# EasyEDA Pro project msq_ethrottle_soic.eprj

# Schematic Schematic

## Sheets
1 MCU: Create Date: 2023-01-29; Page Name: MCU; Project Name: msq-dbw; Schematic Name: Schematic1; Update Date: 2023-03-14; Company: EasyEDA.com; Drawed: EasyEDA Pro; Page Size: A4; Part Number: JLCPCB-002; Reviewed: EasyEDA Pro; Version: V0.1
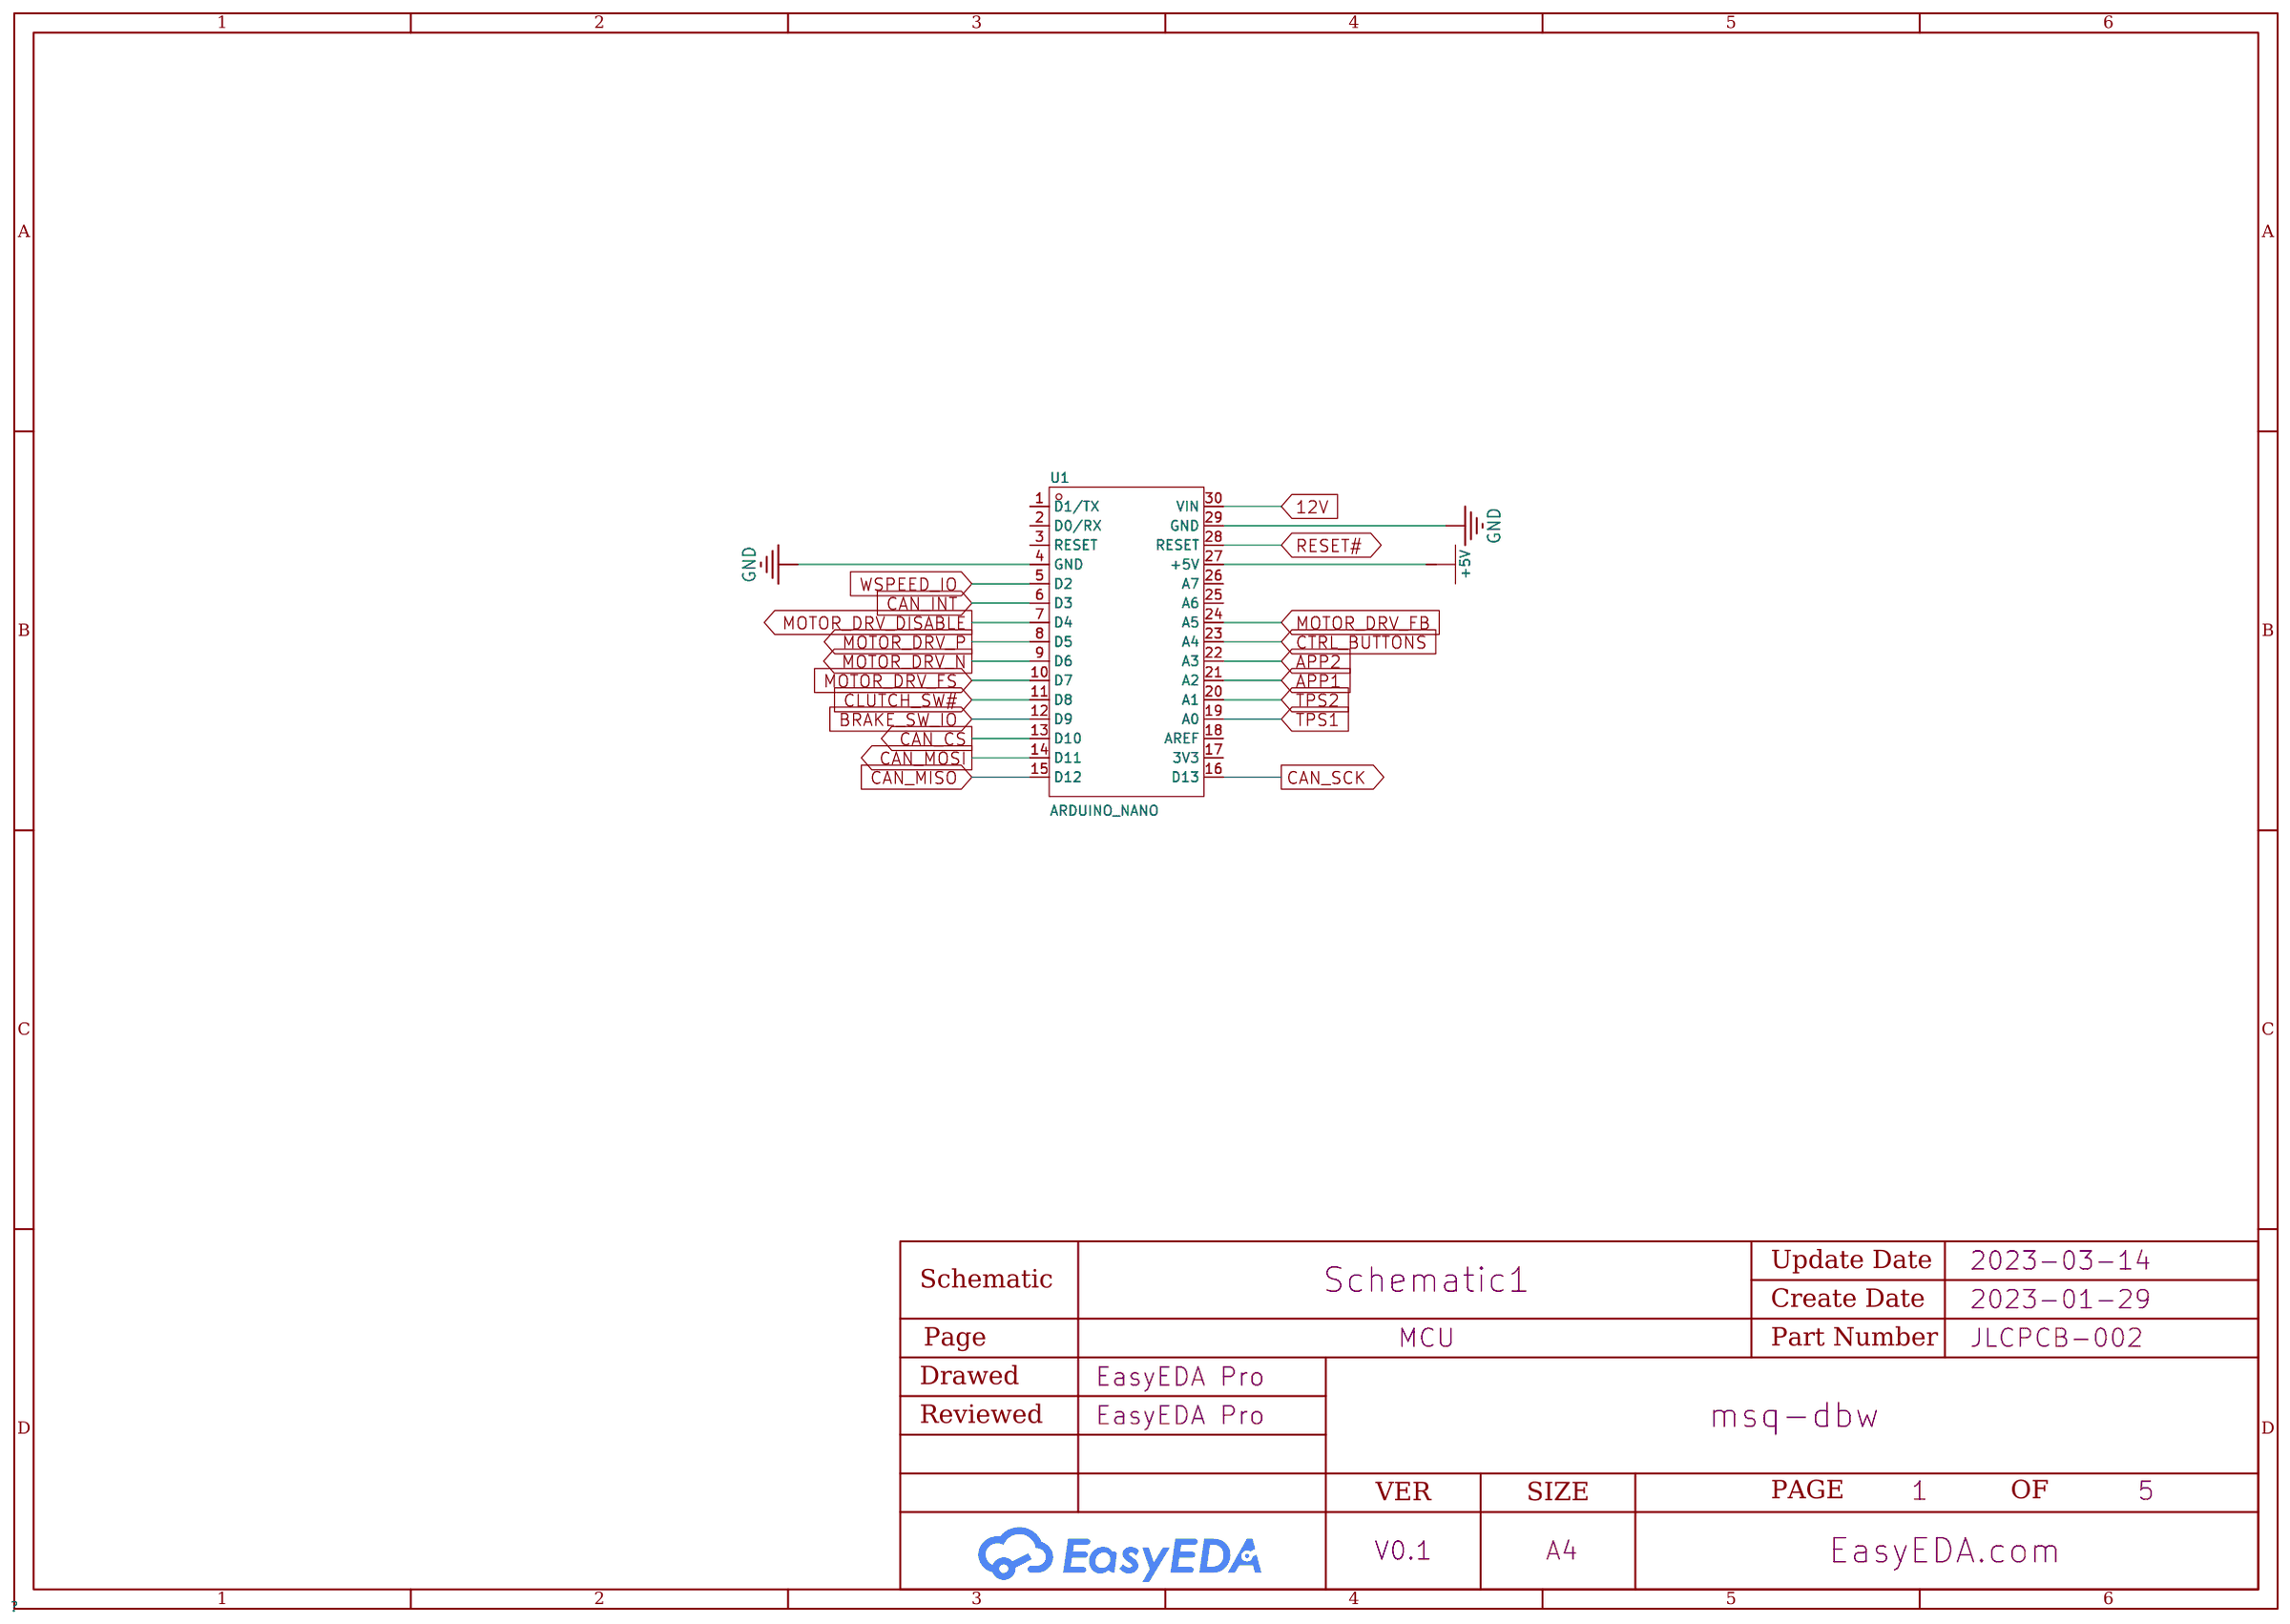
[diagram p0: MCU]
2 I/O: Page Name: I/O; Update Date: 2023-03-11
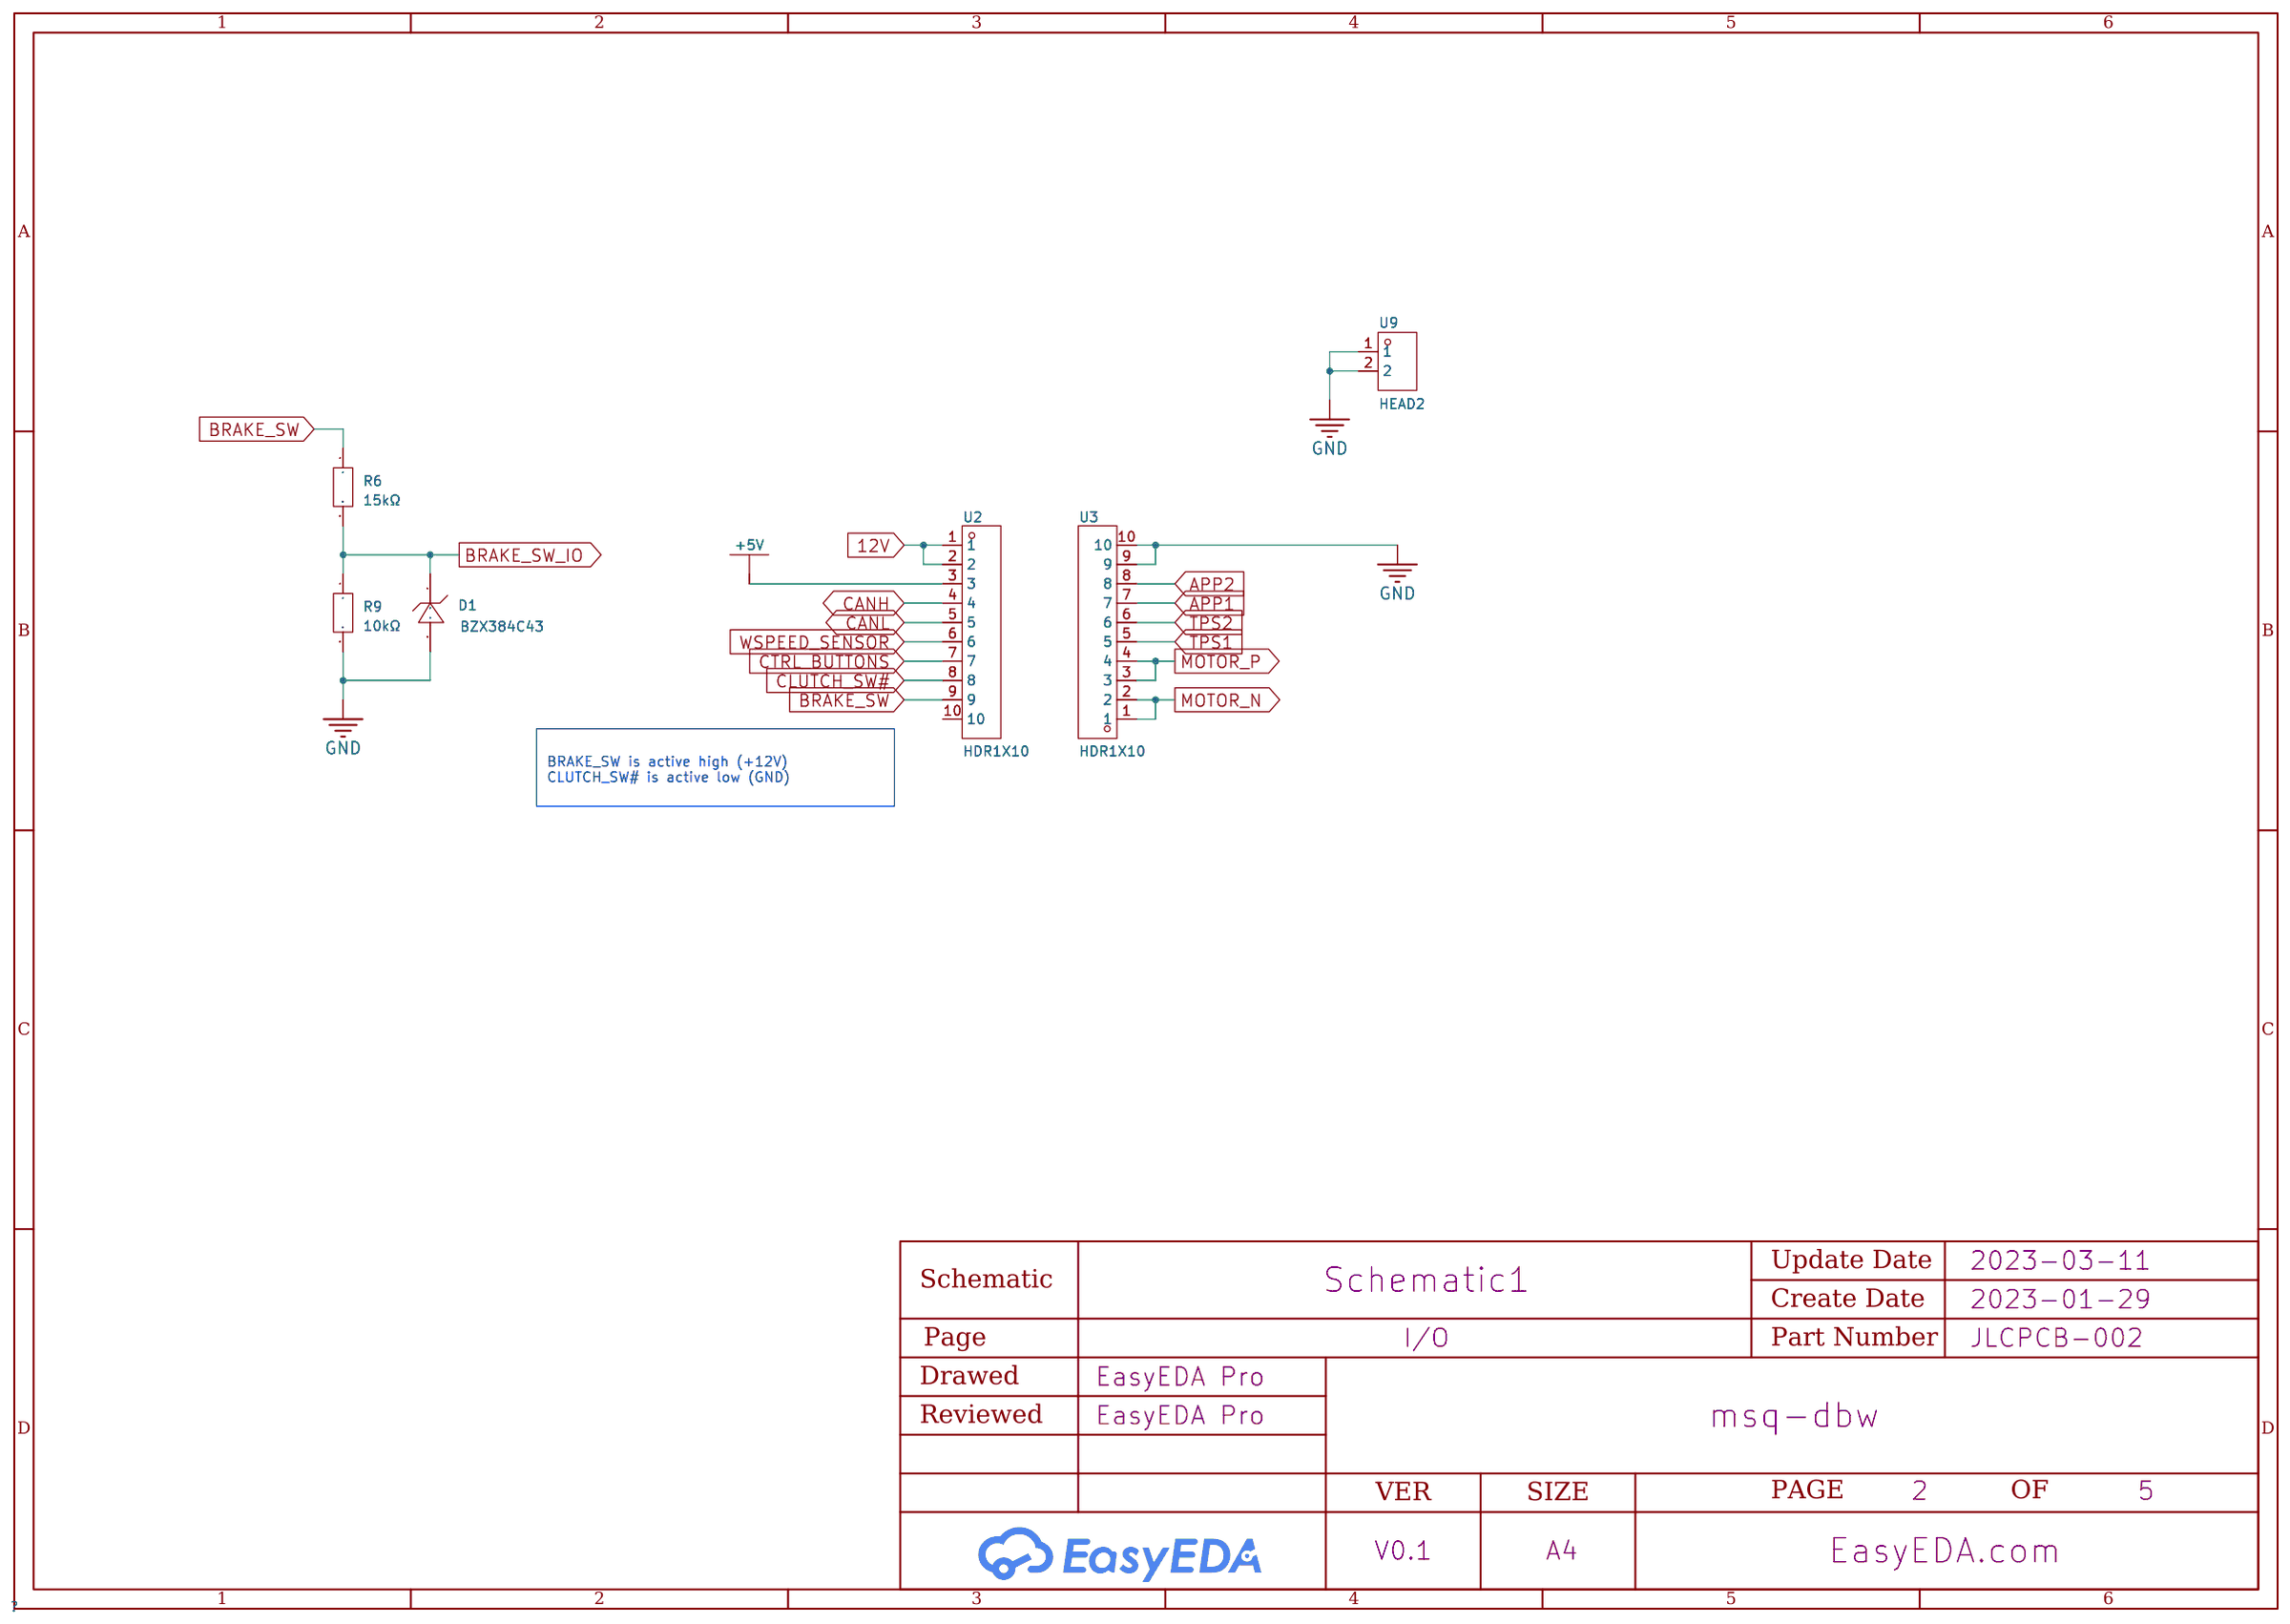
[diagram p1: I/O]
3 CAN: Page Name: CAN; Project Name: msq_ethrottle_soic; Update Date: 2023-03-17
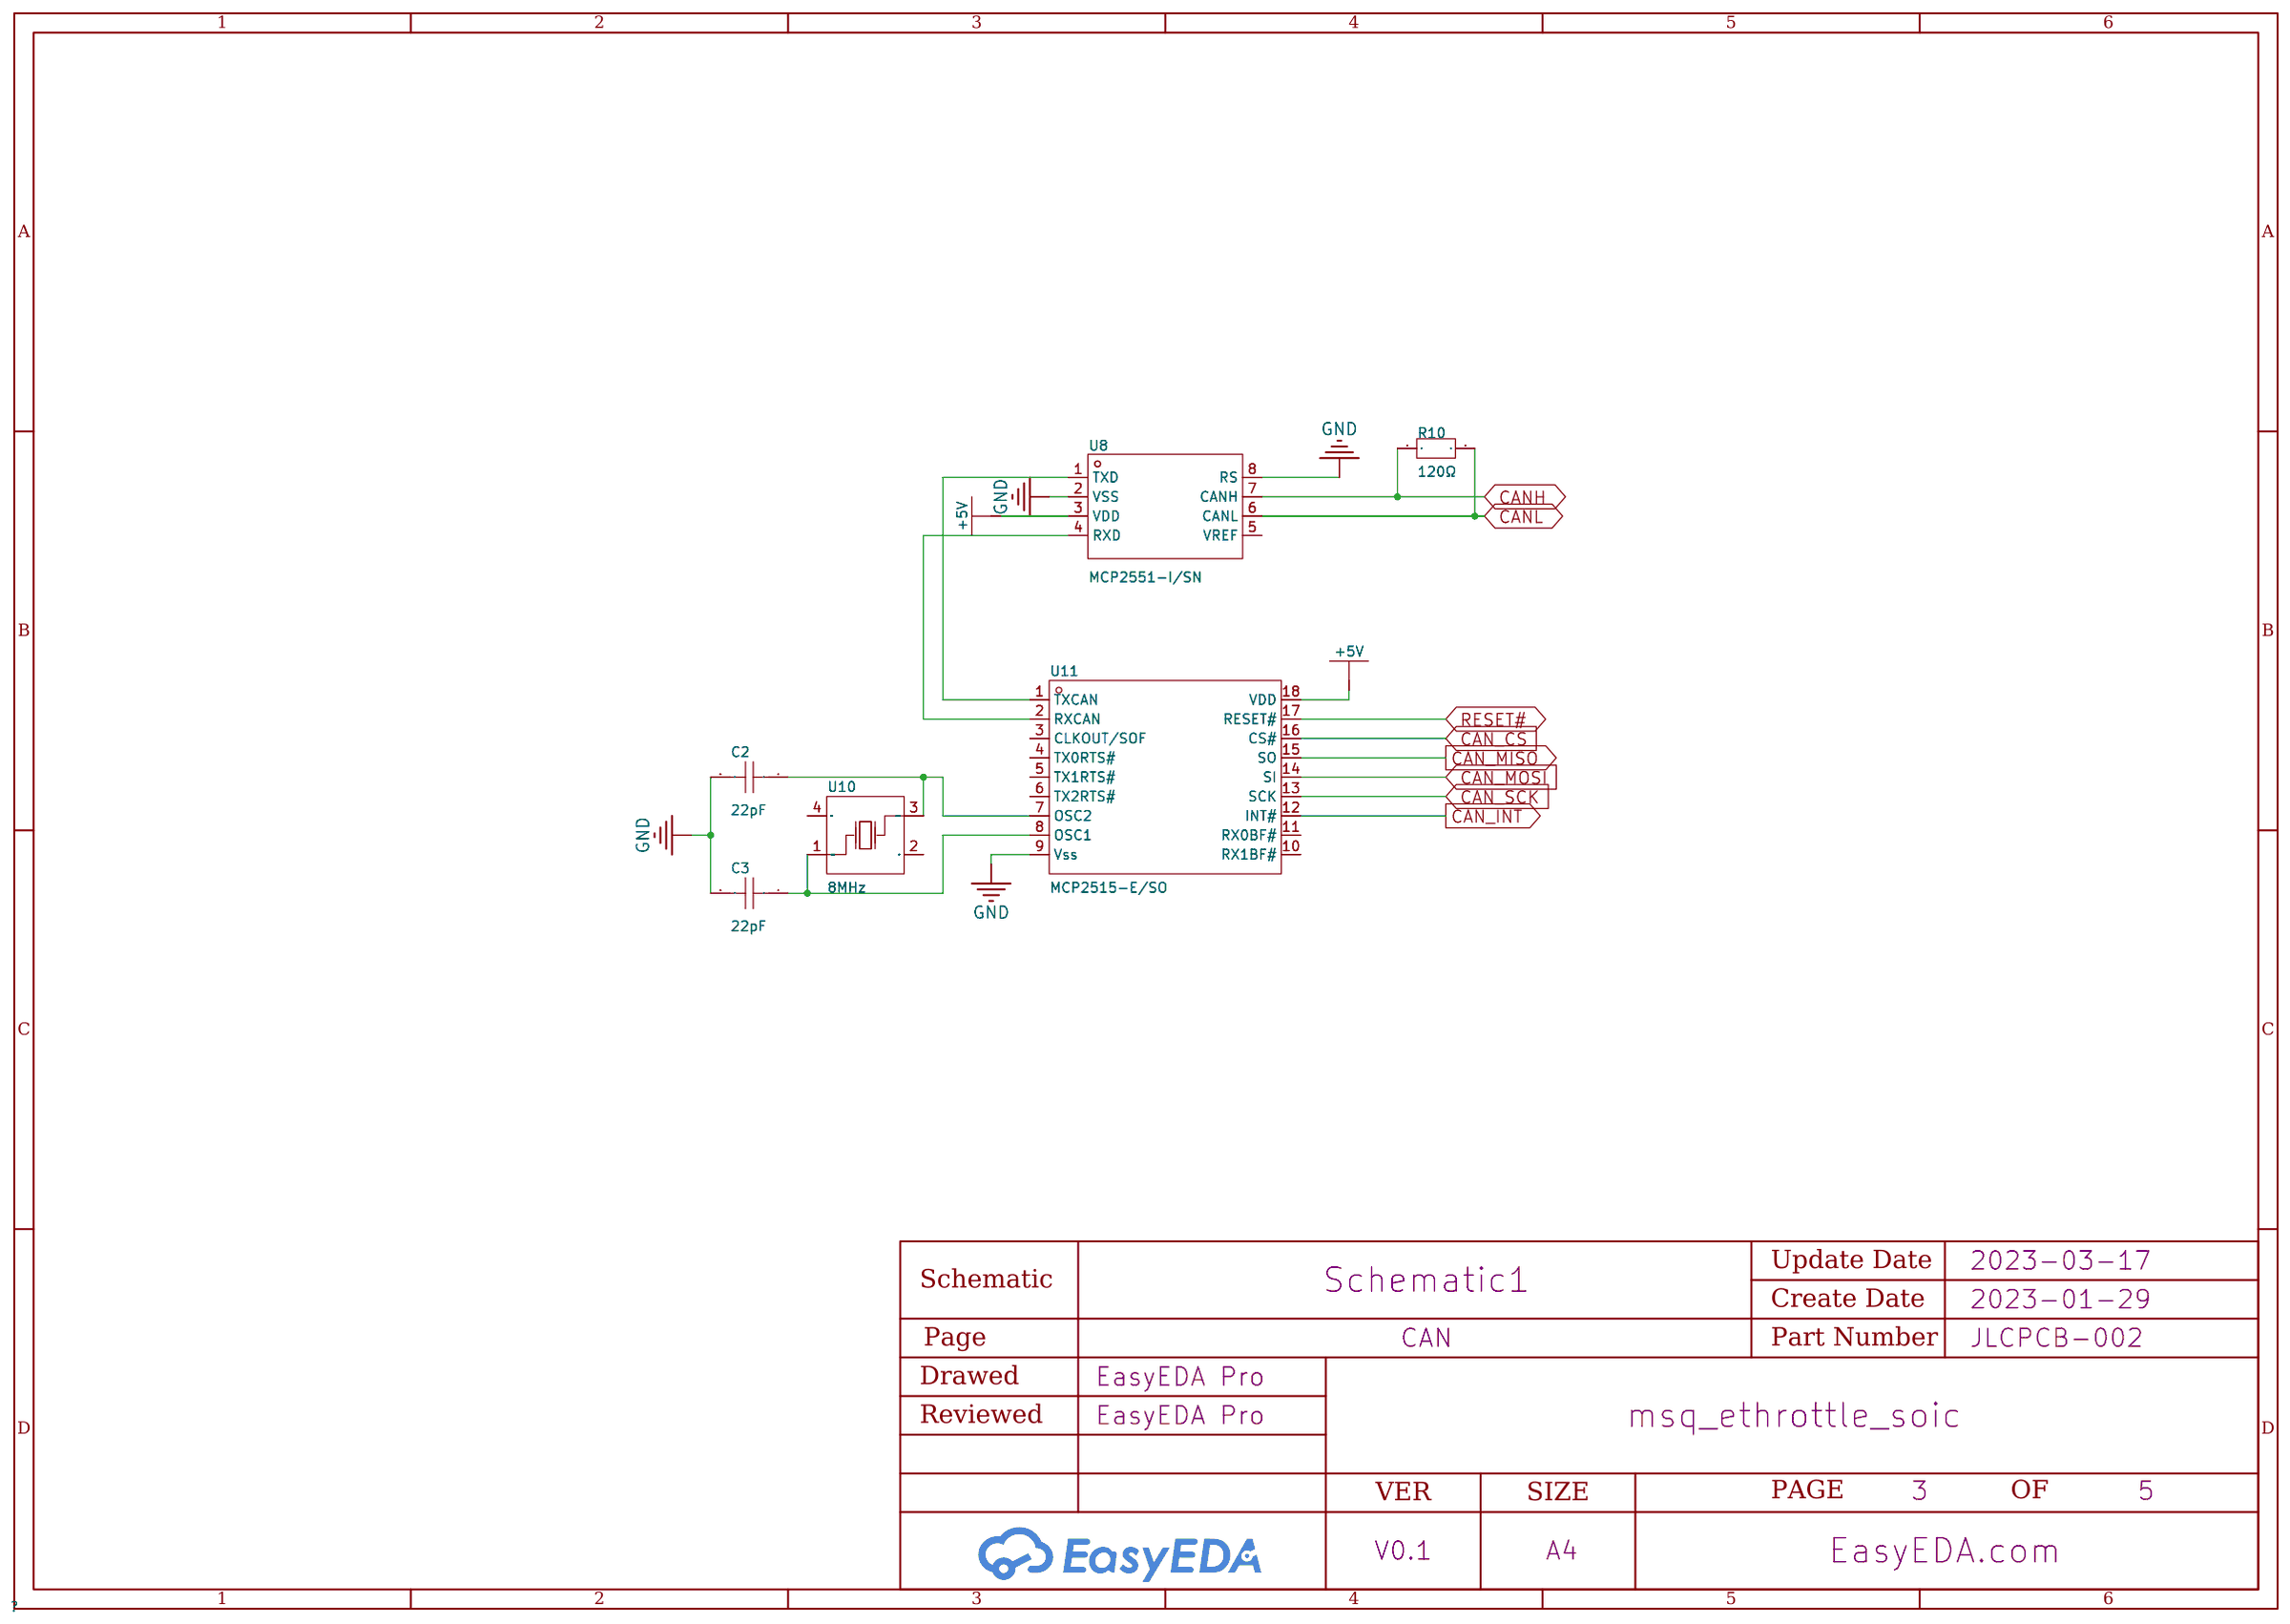
[diagram p2: CAN]
4 WheelSpeed: Page Name: WheelSpeed; Project Name: msq_ethrottle_soic; Schematic Name: Schematic
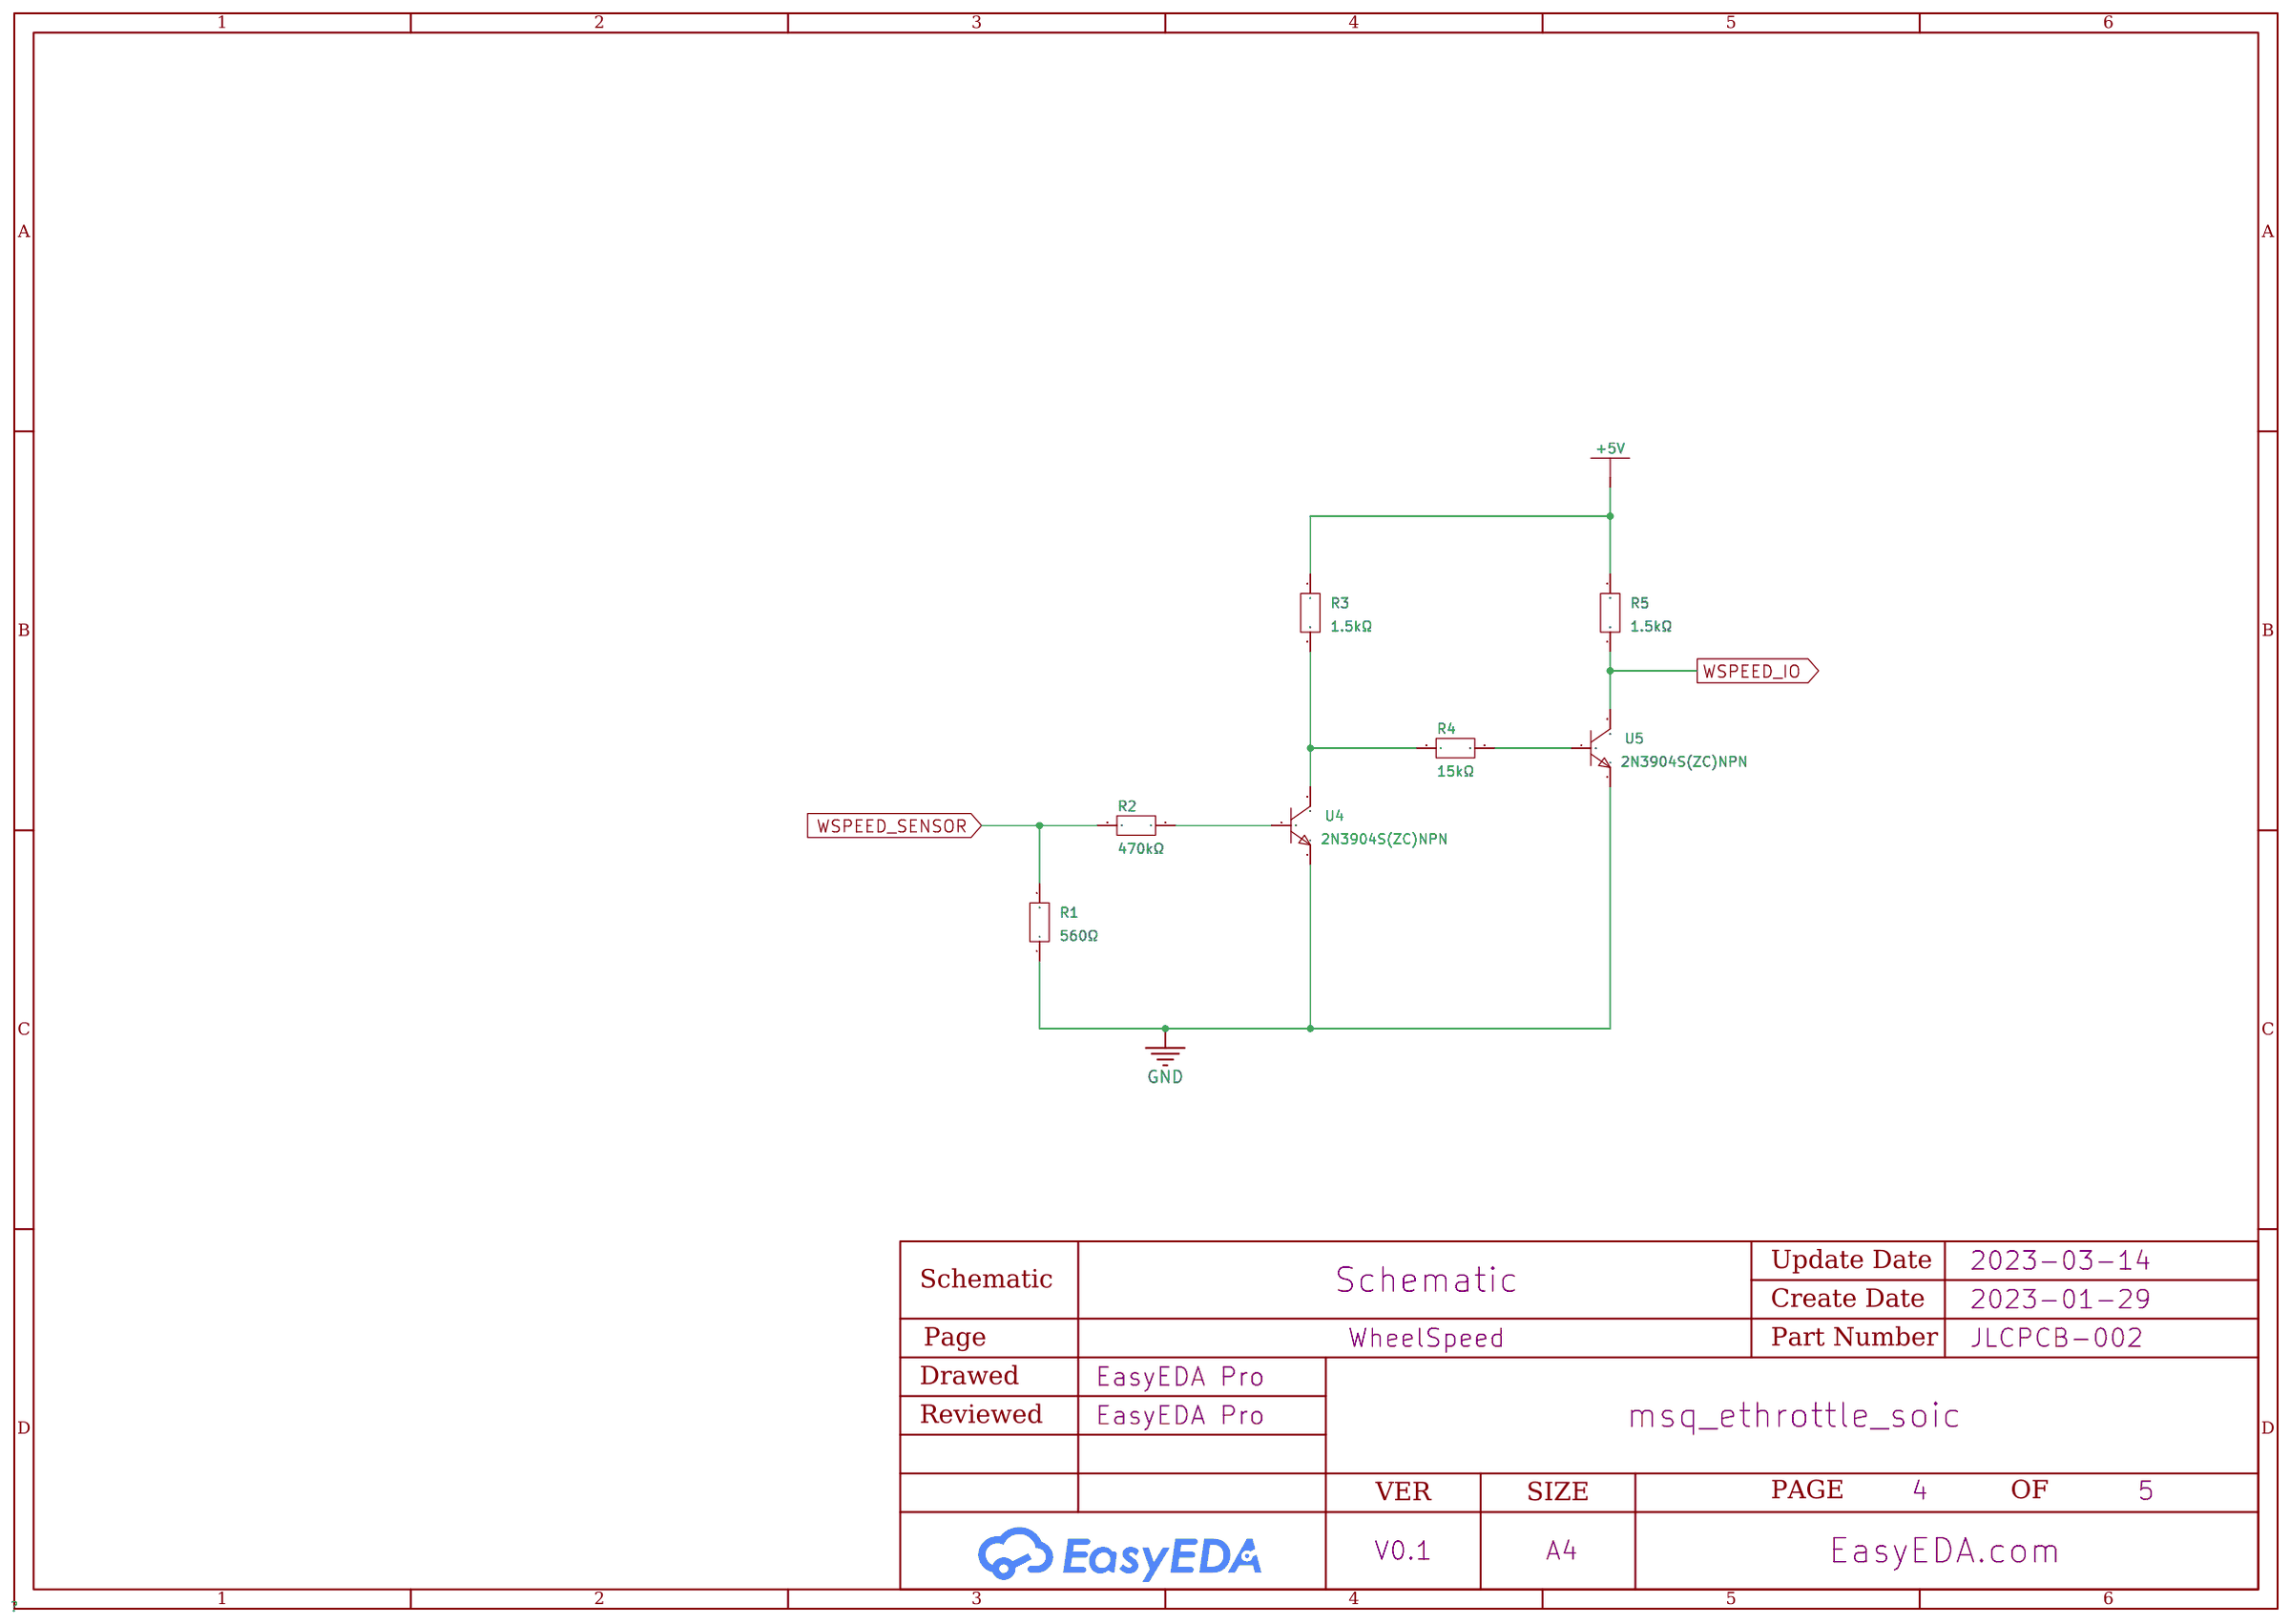
[diagram p3: WheelSpeed]
5 MotorDriver: Page Name: MotorDriver; Project Name: msq_ethrottle_soic; Schematic Name: Schematic
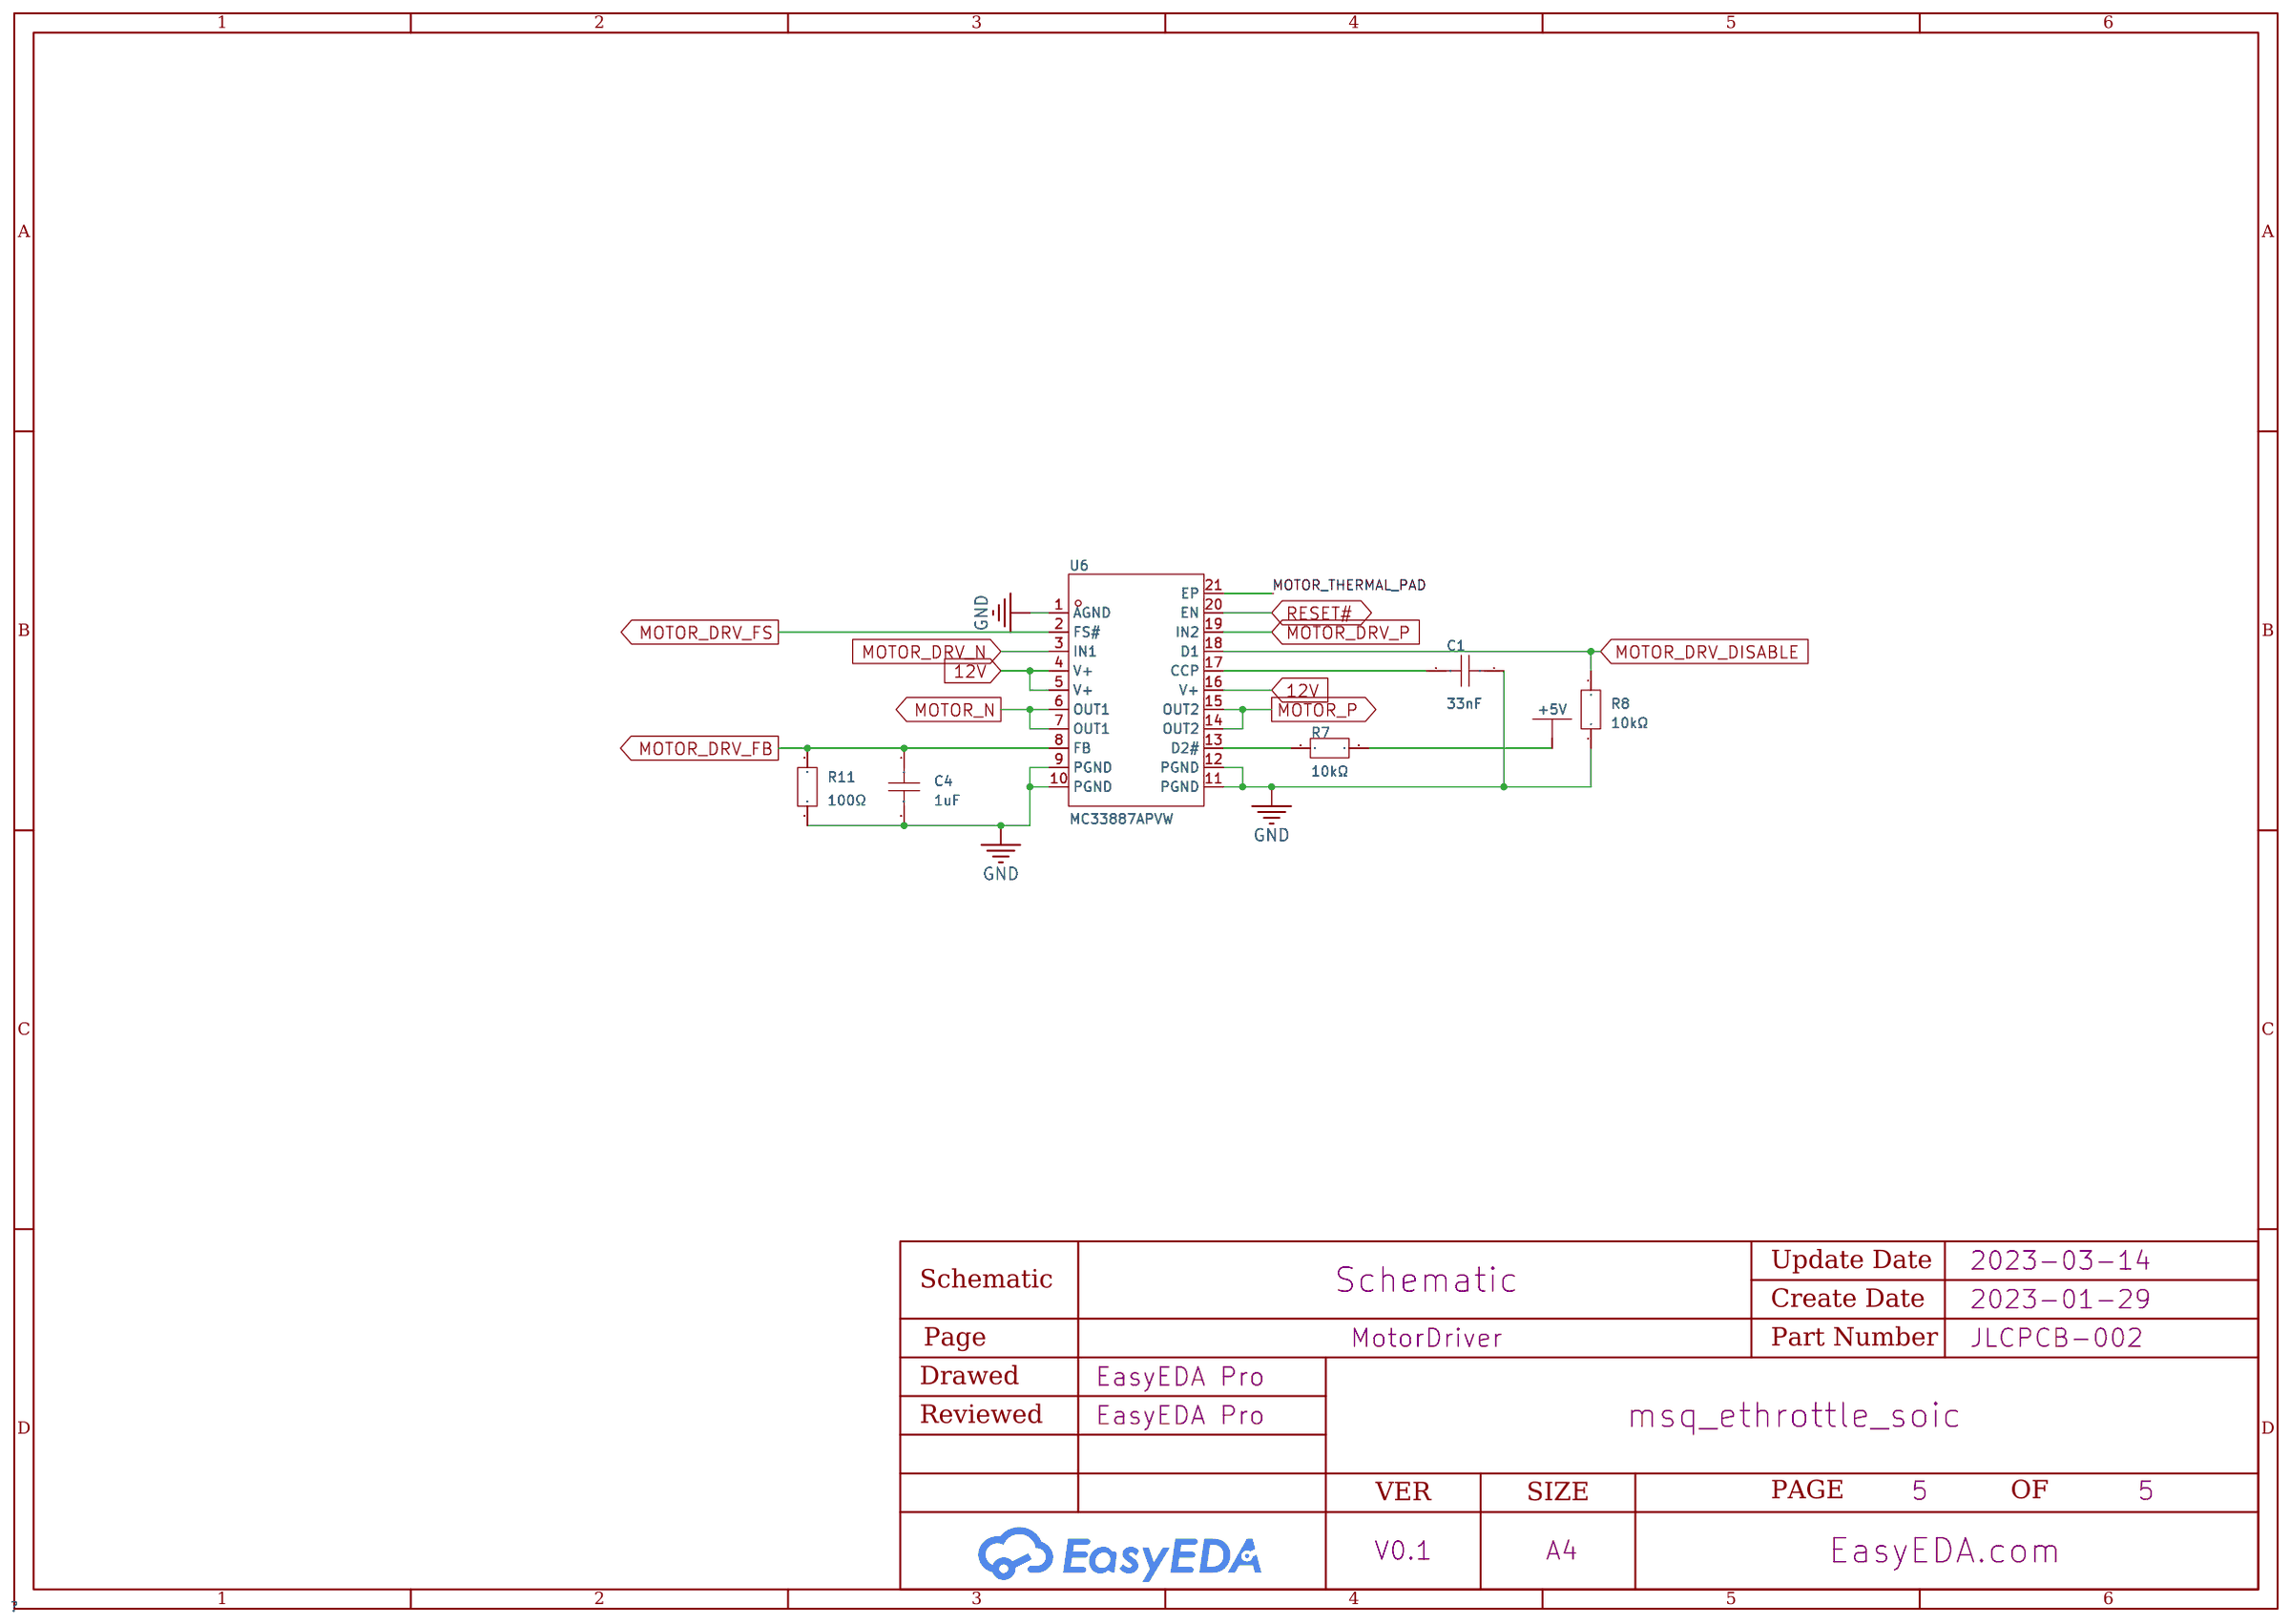
[diagram p4: MotorDriver]

## Parts
sheet CAN
C2  22pF  [C0603]
C3  22pF  [C0603]
R10  120Ω  [R0603]
U8  MCP2551-I/SN  [SOIC-8_L4.9-W3.9-P1.27-LS6.0-BL]
U10  8MHz  [CRYSTAL-SMD_4P-L3.2-W2.5-BL]
U11  MCP2515-E/SO  [SOIC-18_L11.6-W7.5-P1.27-LS10.3-BL]
sheet I/O
D1  BZX384C43  [SOD-323_L1.7-W1.3-LS2.6-RD]
R6  15kΩ  [R0603]
R9  10kΩ  [R0603]
U2  HDR1X10  [HDR-TH_10P-P2.54-V-F_C9900008052]
U3  HDR1X10  [HDR-TH_10P-P2.54-V-F_C9900008052]
U9  HEAD2  [HDR-TH_2P-P2.54-V-M]
sheet MCU
U1  ARDUINO_NANO  [COMM-TH_ARDUINO_NANO]
sheet MotorDriver
C1  33nF  [C0603]
C4  1uF  [C0603]
R7  10kΩ  [R0603]
R8  10kΩ  [R0603]
R11  100Ω  [R0603]
U6  MC33887APVW  [HSOP-20_L15.9-W11.0-P1.27-LS14.2-TL-EP]
sheet WheelSpeed
R1  560Ω  [R0603]
R2  470kΩ  [R0603]
R3  1.5kΩ  [R0603]
R4  15kΩ  [R0603]
R5  1.5kΩ  [R0603]
U4  2N3904S(ZC)NPN  [SOT-23-3_L2.9-W1.3-P0.95-LS2.4-BR]
U5  2N3904S(ZC)NPN  [SOT-23-3_L2.9-W1.3-P0.95-LS2.4-BR]

## Library data of the parts
C1-C4 = CAP_0603: Supplier Footprint: 0603
R1-R11 = 0603WAF1002T5E: Type:Thick Film Resistors Resistance: Tolerance:±1% Tolerance:±1% Power(Watts): Temperature Coefficient:±100ppm/℃ Temperature Coefficient:±100ppm/℃ Overload Voltage (Max): Operating Temperature Range:-55℃~+155℃ Operating Temperature Range:-55℃~+155℃; LCSC Part Name: 10kΩ ±1% 100mW; Supplier Part: C25804; Manufacturer: UNI-ROYAL(厚声); Supplier Footprint: 0603; JLCPCB Part Class: Basic Part; Datasheet: https://atta.szlcsc.com/upload/public/pdf/source/20200306/C422600_1E6D84923E4A46A82E41ADD87F860B5C.pdf; Supplier: LCSC; Type: Thick Film Resistors; Tolerance: ±1%; Temperature Coefficient: ±100ppm/℃; Operating Temperature Range: -55℃~+155℃
U8 = MCP2551-I/SN: Type:Transceiver Supply Voltage:4.5V~5.5V Supply Voltage:4.5V~5.5V; Supplier Part: C7376; Manufacturer: MICROCHIP(美国微芯); Supplier Footprint: SOIC-8-150mil; JLCPCB Part Class: Extended Part; Datasheet: https://atta.szlcsc.com/upload/public/pdf/source/20140724/1457707166784.pdf; Supplier: LCSC; Type: Transceiver; Supply Voltage: 4.5V~5.5V
U10 = L327S270S11L: Frequency:27MHz Frequency Tolerance:±10ppm Frequency Tolerance:±10ppm Load Capacitance: Operating Temperature: Operating Temperature:; LCSC Part Name: 27MHz ±10ppm 18pF; Supplier Part: C5261230; Manufacturer: Lucki(蓝晶); Supplier Footprint: SMD3225-4P; Datasheet: https://atta.szlcsc.com/upload/public/pdf/source/20221202/60F06CA666B721E79745927FA5DE9DEE.pdf; Supplier: LCSC; Frequency Tolerance: ±10ppm
U11 = MCP2515-E/SO: Supplier Part: C642512; Manufacturer: MICROCHIP(美国微芯); Supplier Footprint: SOIC-18-300mil; JLCPCB Part Class: Extended Part; Datasheet: https://atta.szlcsc.com/upload/public/pdf/source/20221017/BDBFE05E0D5D8625D853A9E85ECBB005.pdf; Supplier: LCSC
D1 = BZX384C43: Zener Voltage (Nom):- Zener Voltage (Range):40V~46V Zener Voltage (Range):40V~46V Tolerance:±2% Tolerance:±2% Power Dissipation:200mW Reverse Leakage Current (Ir):50nA@700mV; LCSC Part Name: ±2% 200mW; Supplier Part: C409610; Manufacturer: EIC; Supplier Footprint: SOD-323; JLCPCB Part Class: Extended Part; Datasheet: https://atta.szlcsc.com/upload/public/pdf/source/20190801/C409610_9504911DF9FC98872F7A65F99ECB6C6D.pdf; Supplier: LCSC; Zener Voltage (Range): 40V~46V; Tolerance: ±2%; Power Dissipation: 200mW; Reverse Leakage Current (Ir): 50nA@700mV
U2 U3 = HDR1X10: Supplier Part: C9900008052; Supplier Footprint: 1X10P2.54mm塑高3.5mm; Datasheet: https://atta.szlcsc.comnull; Supplier: LCSC
U9 = HEAD2: Supplier Part: C9900010030; Supplier Footprint: HDR-TH_2P-P2.54; Datasheet: https://atta.szlcsc.comnull; Supplier: LCSC
U1 = ARDUINO_NANO: Supplier Part: C9900017879; Supplier Footprint: 插件; Datasheet: https://atta.szlcsc.comnull; Supplier: LCSC
U6 = MC33887APVW: Type:有刷直流电机 Supply Voltage:5V~28V Supply Voltage:5V~28V Output Current:5A Interface:Parallel Operating Temperature:-40℃~+150℃@(Tj) Operating Temperature:-40℃~+150℃@(Tj); Supplier Part: C1556894; Manufacturer: NXP(恩智浦); Supplier Footprint: HSOP-20-EP-11.0mm; JLCPCB Part Class: Extended Part; Datasheet: https://atta.szlcsc.com/upload/public/pdf/source/20210714/C729071_98FB39D99A873BDAEDBADF85E33ACDF2.pdf; Supplier: LCSC; Type: 有刷直流电机; Supply Voltage: 5V~28V; Output Current: 5A; Interface: Parallel; Operating Temperature: -40℃~+150℃@(Tj)
U4 U5 = 2N3904S(ZC)NPN: Supplier Part: C9900013034; Supplier Footprint: SOT-23; Datasheet: https://atta.szlcsc.comnull; Supplier: LCSC

## Nets
12V: U1.30(VIN) U2.1 U2.2 U6.4(V+) U6.5(V+) U6.16(V+)
+5V: R3.1 R5.2 R7.1 U1.27(+5V) U2.3 U8.3(VDD) U11.18(VDD)
GND: C1.1 C2.2 C3.2 C4.2 D1.2(A) R1.1 R8.2 R9.2 R11.1 U1.4(GND) U1.29(GND) U3.9 U3.10 U4.2(E) U5.2(E) U6.1(AGND) U6.9(PGND) U6.10(PGND) U6.11(PGND) U6.12(PGND) U8.2(VSS) U8.8(RS) U9.1 U9.2 U11.9(Vss)
APP1: U1.21(A2) U3.7
APP2: U1.22(A3) U3.8
BRAKE_SW: R6.1 U2.9
BRAKE_SW_IO: D1.1(C) R6.2 R9.1 U1.12(D9)
CAN_CS: U1.13(D10) U11.16(CS#)
CAN_INT: U1.6(D3) U11.12(INT#)
CAN_MISO: U1.15(D12) U11.15(SO)
CAN_MOSI: U1.14(D11) U11.14(SI)
CAN_SCK: U1.16(D13) U11.13(SCK)
CANH: R10.1 U2.4 U8.7(CANH)
CANL: R10.2 U2.5 U8.6(CANL)
CLUTCH_SW#: U1.11(D8) U2.8
CTRL_BUTTONS: U1.23(A4) U2.7
MOTOR_DRV_DISABLE: R8.1 U1.7(D4) U6.18(D1)
MOTOR_DRV_FB: C4.1 R11.2 U1.24(A5) U6.8(FB)
MOTOR_DRV_FS: U1.10(D7) U6.2(FS#)
MOTOR_DRV_N: U1.9(D6) U6.3(IN1)
MOTOR_DRV_P: U1.8(D5) U6.19(IN2)
MOTOR_N: U3.1 U3.2 U6.6(OUT1) U6.7(OUT1)
MOTOR_P: U3.3 U3.4 U6.14(OUT2) U6.15(OUT2)
MOTOR_THERMAL_PAD: U6.21(EP)
RESET#: U1.28(RESET) U6.20(EN) U11.17(RESET#)
TPS1: U1.19(A0) U3.5
TPS2: U1.20(A1) U3.6
WSPEED_IO: R5.1 U1.5(D2) U5.3(C)
WSPEED_SENSOR: R1.2 R2.2 U2.6
$3N506: U8.1(TXD) U11.1(TXCAN)
$3N511: U8.4(RXD) U11.2(RXCAN)
$3N1213: C2.1 U10.3(Xtal Terminal (Output)) U11.7(OSC2)
$3N1221: C3.1 U10.1(Xtal Terminal (Input)) U11.8(OSC1)
$4N837: R2.1 U4.1(B)
$4N858: R3.2 R4.1 U4.3(C)
$4N875: R4.2 U5.1(B)
$5N1075: R7.2 U6.13(D2#)
$5N1397: C1.2 U6.17(CCP)

Not connected (* = marked no-connect by the designer): U1 1(D1/TX) 2(D0/RX) 3(RESET) 17(3V3) 18(AREF) 25(A6) 26(A7); U2 10; U8 5(VREF); U10 2(GND) 4(GND); U11 3(CLKOUT/SOF) 4(TX0RTS#) 5(TX1RTS#) 6(TX2RTS#) 10(RX1BF#) 11(RX0BF#)

## Notes on the sheets
sheet 2
- BRAKE_SW is active high (+12V)
  CLUTCH_SW# is active low (GND)

# Board PCB
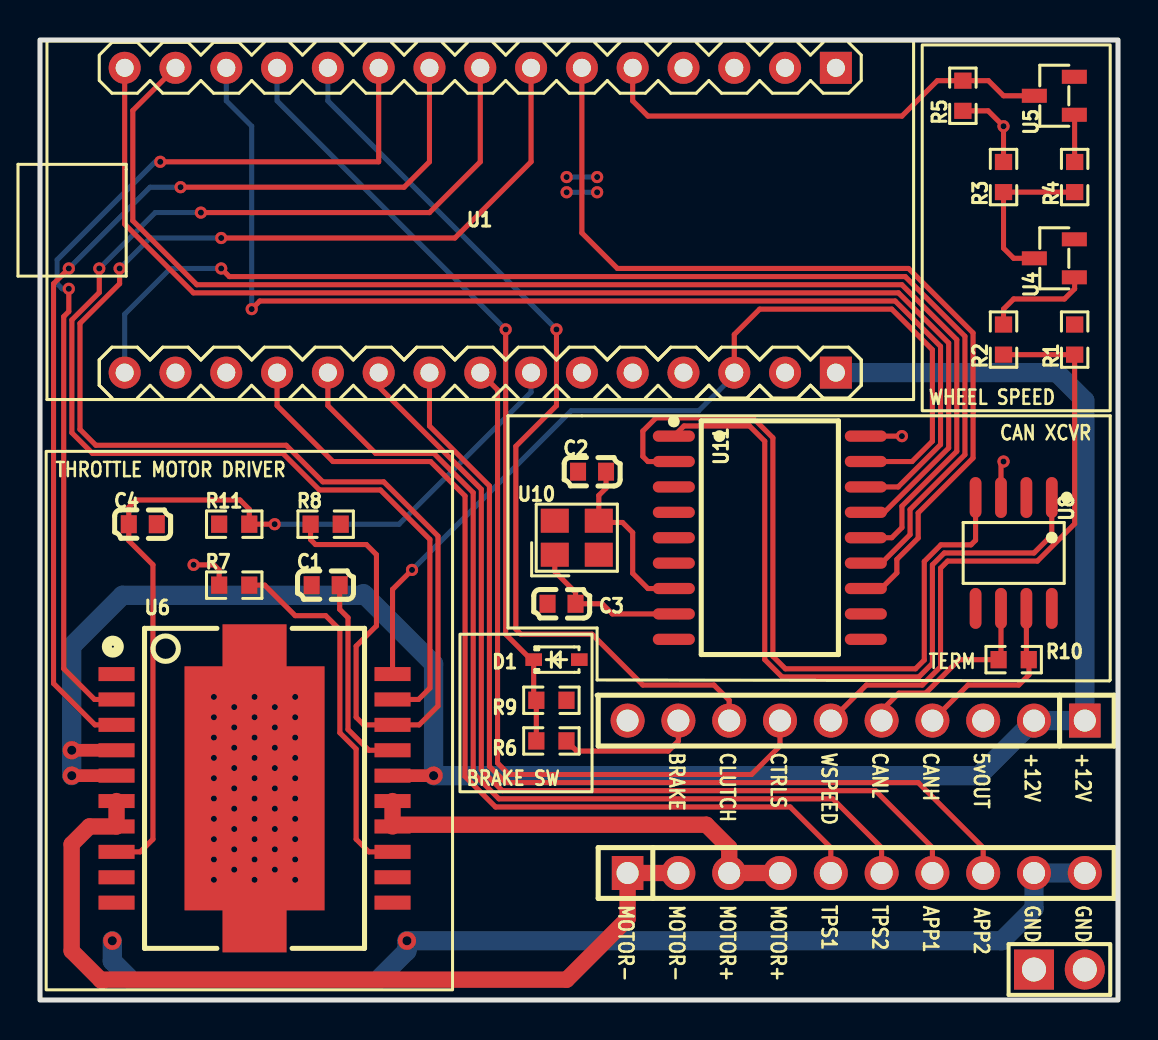
[diagram p5: board, top side]
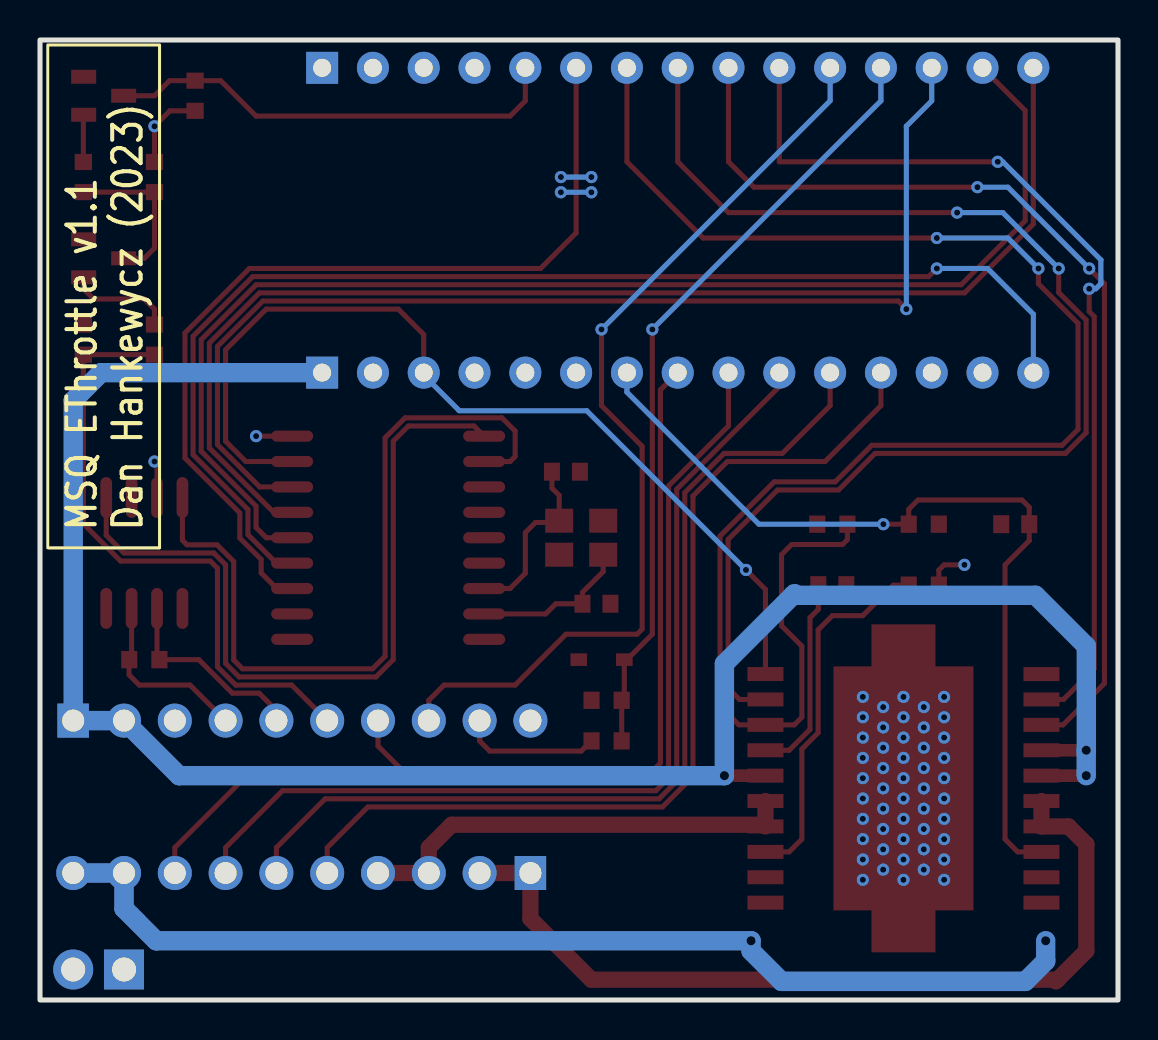
[diagram p6: board, bottom side, seen from below]

Outline 53.9 x 48 mm; copper layers: Top Layer, Bottom Layer. Coordinates in mm from the lower left corner of the outline.
Outline path: rectangle 0,48 53.9,0
Stack: Top Layer 0.035mm / Dielectric1 1.51mm FR4 er 4.5 / Bottom Layer 0.035mm

## Design rules (mm)
spacing safeClearance (default): track to track 0.152, other pairs 0.152 to 0.3
track width trackWidth (default): min 0.127, default 0.254, max 2.54
track width trackWidthMotor: min 0.813, default 1.016, max 2.54
differential pair differentialPair (default): width min 0.127, default 0.254, max 2.54; gap min 0.152, default 0.152
via viaSize (default): diameter min 0.5, default 0.61, max 10; hole min 0.3, default 0.305, max 6
net MOTOR_N uses trackWidthMotor
net MOTOR_P uses trackWidthMotor

## Placement (name value [footprint] x y rotation side)
C1  33nF  [C0603]  14.28 20.74 0 top
C2  22pF  [C0603]  27.6 26.42 180 top
C3  22pF  [C0603]  26.08 19.81 180 top
C4  1uF  [C0603]  5.14 23.79 0 top
D1  BZX384C43  [SOD-323_L1.7-W1.3-LS2.6-RD]  25.82 17.02 0 top
R1  560Ω  [R0603]  51.73 33.02 270 top
R2  470kΩ  [R0603]  48.18 33.02 270 top
R3  1.5kΩ  [R0603]  48.18 41.15 270 top
R4  15kΩ  [R0603]  51.73 41.15 90 top
R5  1.5kΩ  [R0603]  46.14 45.21 270 top
R6  15kΩ  [R0603]  25.57 12.95 180 top
R7  10kΩ  [R0603]  9.71 20.74 0 top
R8  10kΩ  [R0603]  14.28 23.79 0 top
R9  10kΩ  [R0603]  25.57 14.99 0 top
R10  120Ω  [R0603]  48.68 17.02 180 top
R11  100Ω  [R0603]  9.71 23.79 0 top
U1  ARDUINO_NANO  [COMM-TH_ARDUINO_NANO]  22.01 38.99 0 top
U2  HDR1X10  [HDR-TH_10P-P2.54-V-F_C9900008052]  40.81 13.97 180 top
U3  HDR1X10  [HDR-TH_10P-P2.54-V-F_C9900008052]  40.81 6.35 0 top
U4  2N3904S(ZC)NPN  [SOT-23-3_L2.9-W1.3-P0.95-LS2.4-BR]  50.72 37.08 0 top
U5  2N3904S(ZC)NPN  [SOT-23-3_L2.9-W1.3-P0.95-LS2.4-BR]  50.72 45.21 0 top
U6  MC33887APVW  [HSOP-20_L15.9-W11.0-P1.27-LS14.2-TL-EP]  10.73 10.58 0 top
U8  MCP2551-I/SN  [SOIC-8_L4.9-W3.9-P1.27-LS6.0-BL]  48.68 22.35 180 top
U9  HEAD2  [HDR-TH_2P-P2.54-V-M]  50.97 1.52 0 top
U10  8MHz  [CRYSTAL-SMD_4P-L3.2-W2.5-BL]  26.84 23.11 0 top
U11  MCP2515-E/SO  [SOIC-18_L11.6-W7.5-P1.27-LS10.3-BL]  36.49 23.11 270 top

## Footprints (pads in the part's own frame, mm; a bottom-side part is the same pattern mirrored in y, then rotated)
C0603
  rect 0.8x0.9 smd: 1(-0.7,0) 2(0.7,0)
COMM-TH_ARDUINO_NANO
  rect 1.6x1.6 hole 0.9: 1(17.78,7.62) 30(17.78,-7.62)
  round 1.6 hole 0.9: 2(15.24,7.62) 3(12.7,7.62) 4(10.16,7.62) 5(7.62,7.62) 6(5.08,7.62) 7(2.54,7.62) 8(0,7.62) 9(-2.54,7.62) 10(-5.08,7.62) 11(-7.62,7.62) 12(-10.16,7.62) 13(-12.7,7.62) 14(-15.24,7.62) 15(-17.78,7.62) 16(-17.78,-7.62) 17(-15.24,-7.62) 18(-12.7,-7.62) 19(-10.16,-7.62) 20(-7.62,-7.62) 21(-5.08,-7.62) 22(-2.54,-7.62) 23(0,-7.62) 24(2.54,-7.62) 25(5.08,-7.62) 26(7.62,-7.62) 27(10.16,-7.62) 28(12.7,-7.62) 29(15.24,-7.62)
CRYSTAL-SMD_4P-L3.2-W2.5-BL
  rect 1.4x1.2 smd: 1(-1.1,-0.85) 2(1.1,-0.85) 3(1.1,0.85) 4(-1.1,0.85)
HDR-TH_2P-P2.54-V-M
  rect 2x2 hole 1.2: 1(-1.27,0)
  round 2 hole 1.2: 2(1.27,0)
HDR-TH_10P-P2.54-V-F_C9900008052
  rect 1.575x1.7 hole 1.1: 1(-11.43,0)
  round 1.7 hole 1.1: 2(-8.89,0) 3(-6.35,0) 4(-3.81,0) 5(-1.27,0) 6(1.27,0) 7(3.81,0) 8(6.35,0) 9(8.89,0) 10(11.43,0)
HSOP-20_L15.9-W11.0-P1.27-LS14.2-TL-EP
  rect 1.8x0.7 smd: 1(-6.9,5.713) 2(-6.9,4.445) 3(-6.9,3.175) 4(-6.9,1.905) 5(-6.9,0.635) 6(-6.9,-0.635) 7(-6.9,-1.905) 8(-6.9,-3.175) 9(-6.9,-4.447) 10(-6.9,-5.715) 11(6.9,-5.715) 12(6.9,-4.445) 13(6.9,-3.175) 14(6.9,-1.905) 15(6.9,-0.635) 16(6.9,0.635) 17(6.9,1.905) 18(6.9,3.175) 19(6.9,4.445) 20(6.9,5.715)
  custom 7x16.4 smd: 21(0,0)
R0603
  rect 0.806x0.864 smd: 1(-0.753,0) 2(0.753,0)
SOD-323_L1.7-W1.3-LS2.6-RD
  rect 0.83x0.63 smd: 1(-1.14,0) 2(1.14,0)
SOIC-8_L4.9-W3.9-P1.27-LS6.0-BL
  oval 0.588x2.045 smd: 1(-1.905,-2.772) 2(-0.635,-2.772) 3(0.635,-2.772) 4(1.905,-2.772) 5(1.905,2.772) 6(0.635,2.772) 7(-0.635,2.772) 8(-1.905,2.772)
SOIC-18_L11.6-W7.5-P1.27-LS10.3-BL
  oval 0.56x2.1 smd: 1(-5.08,-4.8) 2(-3.81,-4.8) 3(-2.54,-4.8) 4(-1.27,-4.8) 5(0,-4.8) 6(1.27,-4.8) 7(2.54,-4.8) 8(3.81,-4.8) 9(5.08,-4.8) 10(5.08,4.8) 11(3.81,4.8) 12(2.54,4.8) 13(1.27,4.8) 14(0,4.8) 15(-1.27,4.8) 16(-2.54,4.8) 17(-3.81,4.8) 18(-5.08,4.8)
SOT-23-3_L2.9-W1.3-P0.95-LS2.4-BR
  rect 1.25x0.7 smd: 1(1,-0.95) 2(1,0.95) 3(-1,0)

## Nets
As in the schematic.

Pads without a net: U1 1 2 3 17 18 25 26; U2 10; U8 5; U10 2 4; U11 3 4 5 6 10 11

## Via types
v1: diameter 0.61, hole 0.305, Top Layer to Bottom Layer, 70 vias
v2: diameter 0.914, hole 0.457, Top Layer to Bottom Layer, 5 vias

## Routing (per net, layer and track width the routed paths; a pad name or vN(x,y) marks a point on that pad's centre or on a via; arc(x,y) is an arc through that point)
12V: length 102
  Top Layer w0.635: U6.4 v2(1.59,12.49) ; v2(19.68,11.22) U6.16 ; U6.5 v2(1.59,11.22)
  Bottom Layer w0.965: 16.26,20.23 4.12,20.23 1.58,17.69 1.58,12.49 v2(1.59,12.49) v2(1.59,11.22) ; 16.26,20.23 16.17,20.32 ; 16.26,20.23 19.68,16.81 v2(19.68,11.22) 46.95,11.22 U2.2 U2.1 52.24,29.97 50.84,31.37 U1.30
+5V: length 9.9
  Top Layer w0.254: R7.1 8.96,21.5 8.69,21.76 v1(7.68,21.76) ; v1(43.1,28.19) U11.18 ; U8.3 48.05,26.8 v1(48.18,26.92) ; R3.1 v1(48.18,43.69) 47.41,44.46 R5.2
GND: length 56.7
  Bottom Layer w0.254: v1(26.33,40.39) v1(27.86,40.39) ; v1(26.33,41.15) v1(27.86,41.15)
  Bottom Layer w0.965: v2(3.61,2.96) 3.61,1.95 4.63,0.93 16.82,0.93 18.35,2.45 v2(18.35,2.96) 48.09,2.96 49.7,4.57 U3.9 U3.10
APP1: length 47.4
  Top Layer w0.254: U1.21 16.93,30.67 22.06,25.54 22.06,11.51 23.11,10.47 41.78,10.47 44.62,7.62 U3.7
APP2: length 48.6
  Top Layer w0.254: U1.22 19.47,28.7 22.47,25.7 22.47,11.68 23.28,10.87 43.91,10.87 47.16,7.62 U3.8
BRAKE_SW: length 7
  Top Layer w0.254: U2.9 31.92,12.95 31.41,12.45 26.84,12.45 26.33,12.95
BRAKE_SW_IO: length 39.1
  Top Layer w0.254: v1(23.28,33.53) 23.28,18.29 24.55,17.02 D1.1 24.68,15.12 R9.1 R6.2
  Bottom Layer w0.254: v1(23.28,33.53) 11.85,44.96 11.85,46.61
CAN_CS: length 57.7
  Top Layer w0.254: v1(10.58,34.54) 10.99,34.95 42.76,34.95 45.03,32.68 45.03,27.77 42.91,25.65 U11.16
  Bottom Layer w0.254: 9.31,46.61 9.31,44.96 10.58,43.69 v1(10.58,34.54)
CAN_INT: length 45.3
  Top Layer w0.254: 27.09,46.61 27.09,38.35 28.87,36.58 43.43,36.58 46.65,33.35 46.65,27.1 43.91,24.36 43.91,23.1 42.84,22.03 42.84,21.35 42.06,20.57 U11.12
CAN_MISO: length 62.2
  Top Layer w0.254: 4.23,46.61 4.23,38.8 7.67,35.36 42.92,35.36 45.43,32.85 45.43,27.6 42.21,24.38 U11.15
CAN_MOSI: length 64.7
  Top Layer w0.254: 6.77,46.61 4.64,44.48 4.64,38.96 7.84,35.76 43.09,35.76 45.84,33.02 45.84,27.44 43.1,24.69 43.1,23.62 42.59,23.11 U11.14
CAN_SCK: length 61.1
  Top Layer w0.254: v1(9.06,36.58) 9.47,36.17 43.26,36.17 46.25,33.19 46.25,27.27 43.5,24.52 43.5,23.27 42.08,21.84 U11.13
  Bottom Layer w0.254: v1(9.06,36.58) 6.52,36.58 4.23,34.29 U1.16
CANH: length 9.1
  Top Layer w0.254: U2.4 46.4,15.75 48.94,15.75 49.45,16.26 49.45,17.01 R10.1 49.32,17.14 U8.7
CANL: length 10
  Top Layer w0.254: U2.5 42.08,14.48 42.94,15.34 44.28,15.34 45.96,17.02 R10.2 48.05,17.14 U8.6
CLUTCH_SW#: length 46.8
  Top Layer w0.254: U2.8 34.46,14.99 33.7,15.75 30.14,15.75 27.6,18.29 24.05,18.29 23.79,18.54 23.79,27.69 25.82,29.72 v1(25.82,33.53)
  Bottom Layer w0.254: 14.39,46.61 14.39,44.96 v1(25.82,33.53)
CTRL_BUTTONS: length 36.1
  Top Layer w0.254: U2.7 37,12.7 35.58,11.28 23.45,11.28 22.88,11.85 22.88,30.51 U1.23
MOTOR_DRV_DISABLE: length 82.5
  Top Layer w0.254: R8.1 13.53,23.02 13.78,22.77 16.31,22.77 16.82,22.27 16.82,18.71 15.81,17.69 15.81,14.14 16.19,13.76 U6.18 18.96,13.76 19.9,14.7 19.9,23.2 17.19,25.91 14.14,25.91 12.31,27.74 2.79,27.74 2,28.53 2,33.83 3.98,35.81 v1(3.98,36.58) ; 24.55,46.61 24.55,41.91 20.74,38.1 v1(9.06,38.1)
  Bottom Layer w0.254: v1(9.06,38.1) 5.5,38.1 v1(3.98,36.58)
MOTOR_DRV_FB: length 44.1
  Top Layer w0.254: U6.8 5.01,7.41 5.65,8.04 5.65,21.76 4.44,22.97 C4.1 4.44,24.64 4.8,25 10,25 10.46,24.54 R11.2 v1(11.73,23.79)
  Bottom Layer w0.254: v1(11.73,23.79) 17.95,23.79 24.55,30.39 U1.24
MOTOR_DRV_FS: length 47.1
  Top Layer w0.254: 3.83,15.03 2.73,15.03 1.19,16.57 1.19,34.17 1.44,34.42 v1(1.44,35.56) ; v1(6.01,41.91) 16.93,41.91 16.93,46.61
  Bottom Layer w0.254: v1(1.44,35.56) 1.11,35.56 0.86,35.81 0.86,37.01 5.76,41.91 v1(6.01,41.91)
MOTOR_DRV_N: length 50
  Top Layer w0.254: v1(7.03,40.64) 18.2,40.64 19.47,41.91 19.47,46.61 ; v1(1.44,36.58) 0.68,35.81 0.68,15.83 2.75,13.76 U6.3
  Bottom Layer w0.254: v1(7.03,40.64) 5.5,40.64 v1(1.44,36.58)
MOTOR_DRV_P: length 64.4
  Top Layer w0.254: v1(8.04,39.37) 19.47,39.37 22.01,41.91 22.01,46.61 ; 17.63,15.03 18.93,15.03 19.49,15.59 19.49,23.03 17.02,25.5 13.97,25.5 12.14,27.33 2.62,27.33 1.59,28.36 1.59,34 2.96,35.37 v1(2.96,36.58)
  Bottom Layer w0.254: v1(2.96,36.58) 5.76,39.37 v1(8.04,39.37)
MOTOR_N: length 43.8
  Top Layer w0.813: 3.02,1.02 1.58,2.45 1.58,7.79 2.47,8.68 U6.7 3.83,9.95 ; 3.02,1.02 26.33,1.02 29.38,4.06 U3.1 U3.2 ; 3.02,1.02 3.11,0.93
MOTOR_P: length 22.4
  Top Layer w0.813: U3.4 U3.3 34.46,7.62 33.32,8.76 17.63,8.76 ; U6.14 17.63,8.76 ; 17.63,8.76 17.63,9.95
MOTOR_THERMAL_PAD:
  vias: v1(8.69,15.15) v1(8.69,14.14) v1(8.69,13.12) v1(8.69,12.11) v1(8.69,11.09) v1(8.69,10.07) v1(8.69,9.06) v1(8.69,8.04) v1(8.69,7.03) v1(8.69,6.01) v1(9.71,14.65) v1(9.71,13.63) v1(9.71,12.61) v1(9.71,11.6) v1(9.71,10.58) v1(9.71,9.57) v1(9.71,8.55) v1(9.71,7.53) v1(9.71,6.52) v1(10.73,15.15) v1(10.73,14.14) v1(10.73,13.12) v1(10.73,12.11) v1(10.73,11.09) v1(10.73,10.07) v1(10.73,9.06) v1(10.73,8.04) v1(10.73,7.03) v1(10.73,6.01) v1(11.74,14.65) v1(11.74,13.63) v1(11.74,12.61) v1(11.74,11.6) v1(11.74,10.58) v1(11.74,9.57) v1(11.74,8.55) v1(11.74,7.53) v1(11.74,6.52) v1(12.76,15.15) v1(12.76,14.14) v1(12.76,13.12) v1(12.76,12.11) v1(12.76,11.09) v1(12.76,10.07) v1(12.76,9.06) v1(12.76,8.04) v1(12.76,7.03) v1(12.76,6.01)
RESET#: length 47.4
  Top Layer w0.254: U11.17 43.6,26.92 44.62,27.94 44.62,32.51 42.59,34.54 35.98,34.54 34.71,33.27 U1.28 ; U6.20 17.63,20.53 v1(18.6,21.5)
  Bottom Layer w0.254: v1(18.6,21.5) 26.56,29.46 32.94,29.46 34.71,31.24 U1.28
TPS1: length 48
  Top Layer w0.254: U1.19 11.85,29.72 14.65,26.92 19.53,26.92 21.25,25.2 21.25,11.18 22.78,9.65 37.51,9.65 39.54,7.62 U3.5
TPS2: length 48
  Top Layer w0.254: U1.20 14.39,29.72 16.78,27.33 19.7,27.33 21.66,25.37 21.66,11.34 22.94,10.06 39.64,10.06 42.08,7.62 U3.6
WSPEED_IO: length 23.1
  Top Layer w0.254: U5.3 48.18,45.21 47.42,45.97 R5.1 44.87,45.97 43.1,44.2 30.4,44.2 29.63,44.96 29.63,46.61
WSPEED_SENSOR: length 31.2
  Top Layer w0.254: R2.2 R1.2 51.73,23.81 49.87,21.95 45.38,21.95 45.03,21.59 45.03,16.66 44.11,15.75 41.32,15.75 U2.6
$3N506: length 38.4
  Top Layer w0.254: U11.1 32.2,28.7 35.48,28.7 36.24,27.94 36.24,17.02 37.1,16.15 43.94,16.15 44.62,16.83 44.62,21.76 45.21,22.35 49.7,22.35 50.59,23.24 U8.1
$3N511: length 39.1
  Top Layer w0.254: U8.4 46.78,22.99 46.55,22.76 45.05,22.76 44.21,21.93 44.21,17 43.78,16.56 37.27,16.56 36.64,17.19 36.64,28.11 35.64,29.11 30.8,29.11 30.14,28.45 30.14,27.18 30.4,26.92 U11.2
$3N1213: length 8.9
  Top Layer w0.254: U11.7 30.4,20.57 29.63,21.34 29.63,23.37 29.13,23.88 28.03,23.88 U10.3 27.94,25.23 28.3,25.59 C2.1
$3N1221: length 8
  Top Layer w0.254: U10.1 25.74,21.42 26.78,20.38 C3.1 28.11,19.81 28.62,19.3 U11.8
$4N837: length 5.3
  Top Layer w0.254: R2.1 48.18,34.54 48.68,35.05 51.22,35.05 51.73,35.56 51.73,36.12 U4.1
$4N858: length 8.1
  Top Layer w0.254: R4.1 R3.2 48.18,37.59 48.68,37.08 U4.3
$4N875: length 2.4
  Top Layer w0.254: U5.1 51.73,44.25 R4.2
$5N1075: length 18.3
  Top Layer w0.254: U6.13 16.44,7.41 15.81,8.04 15.81,12.55 14.99,13.36 14.99,18.51 14.28,19.22 12.76,19.22 11.24,20.74 R7.2
$5N1397: length 10
  Top Layer w0.254: U6.17 16.44,12.49 15.4,13.53 15.4,19.12 14.98,19.53 14.98,20.74

## Copper pours and planes (outline as drawn; the poured copper is in the pictures)
+5V on Bottom Layer: 0,48 53.9,48 53.9,0 0,0
GND on Top Layer: 0,48 53.9,48 53.9,0 0,0
MOTOR_THERMAL_PAD on Top Layer: 5.23,18.58 16.23,18.58 16.23,2.58 5.23,2.58
MOTOR_THERMAL_PAD on Bottom Layer: 5.23,18.58 16.23,18.58 16.23,2.58 5.23,2.58

## Text on the board
Bottom Silkscreen Layer: MSQ EThrottle v1.1 / Dan Hankewycz (2023)
Top Silkscreen Layer: MOTOR- | MOTOR+ | THROTTLE MOTOR DRIVER | BRAKE SW | WHEEL SPEED | TERM | CAN XCVR | BRAKE | CLUTCH | CTRLS | WSPEED | TPS1 | CANL | TPS2 | CANH | APP1 | 5vOUT | APP2 | +12V | GND
